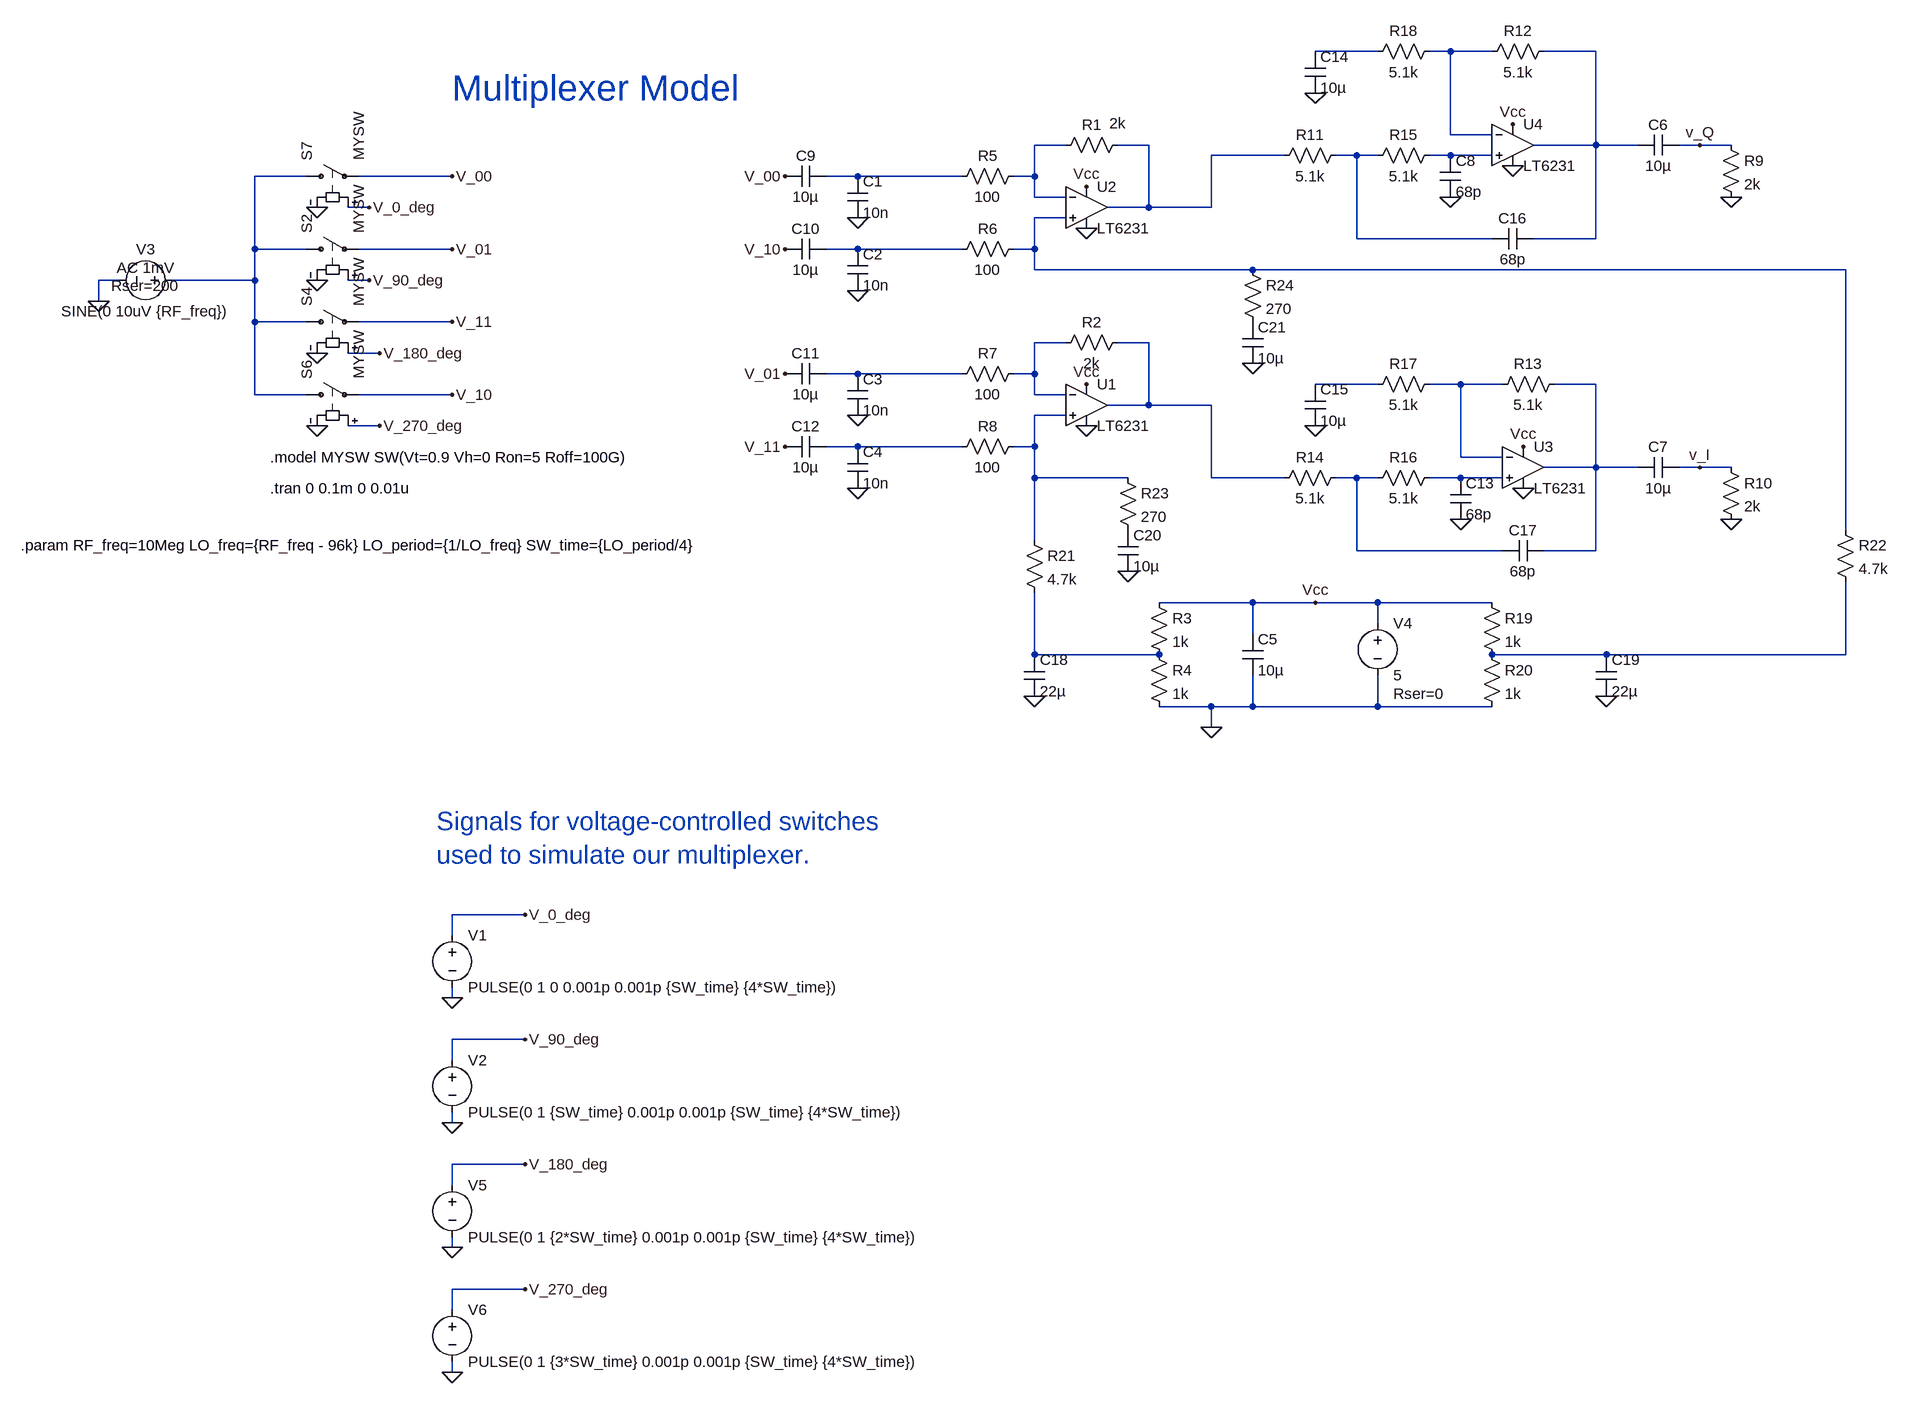
[diagram p0: schematic MUXModel_3.asc]
MUXModel_3.asc, the LTspice schematic file:
Version 4
SHEET 1 2640 1364
WIRE 1376 -688 1280 -688
WIRE 1488 -688 1456 -688
WIRE 1552 -688 1488 -688
WIRE 1712 -688 1632 -688
WIRE 1488 -560 1488 -688
WIRE 1552 -560 1488 -560
WIRE 896 -544 848 -544
WIRE 1024 -544 976 -544
WIRE 1712 -544 1712 -688
WIRE 1712 -544 1616 -544
WIRE 1776 -544 1712 -544
WIRE 1872 -544 1840 -544
WIRE 1920 -544 1872 -544
WIRE 1232 -528 1120 -528
WIRE 1344 -528 1312 -528
WIRE 1376 -528 1344 -528
WIRE 1488 -528 1456 -528
WIRE 1552 -528 1488 -528
WIRE -272 -496 -352 -496
WIRE -48 -496 -192 -496
WIRE 576 -496 528 -496
WIRE 736 -496 576 -496
WIRE 848 -496 848 -544
WIRE 848 -496 816 -496
WIRE 848 -464 848 -496
WIRE 896 -464 848 -464
WIRE -176 -448 -208 -448
WIRE 1024 -448 1024 -544
WIRE 1024 -448 960 -448
WIRE 1120 -448 1120 -528
WIRE 1120 -448 1024 -448
WIRE 896 -432 848 -432
WIRE 1344 -400 1344 -528
WIRE 1552 -400 1344 -400
WIRE 1712 -400 1712 -544
WIRE 1712 -400 1616 -400
WIRE -352 -384 -352 -496
WIRE -272 -384 -352 -384
WIRE -48 -384 -192 -384
WIRE 576 -384 528 -384
WIRE 736 -384 576 -384
WIRE 848 -384 848 -432
WIRE 848 -384 816 -384
WIRE 848 -352 848 -384
WIRE 1184 -352 848 -352
WIRE 2096 -352 1184 -352
WIRE -560 -336 -592 -336
WIRE -352 -336 -352 -384
WIRE -352 -336 -480 -336
WIRE -176 -336 -208 -336
WIRE -592 -304 -592 -336
WIRE -352 -272 -352 -336
WIRE -272 -272 -352 -272
WIRE -48 -272 -192 -272
WIRE 896 -240 848 -240
WIRE 1024 -240 976 -240
WIRE -160 -224 -208 -224
WIRE 576 -192 528 -192
WIRE 736 -192 576 -192
WIRE 848 -192 848 -240
WIRE 848 -192 816 -192
WIRE 1376 -176 1280 -176
WIRE 1504 -176 1456 -176
WIRE 1568 -176 1504 -176
WIRE 1712 -176 1648 -176
WIRE -352 -160 -352 -272
WIRE -272 -160 -352 -160
WIRE -48 -160 -192 -160
WIRE 848 -160 848 -192
WIRE 896 -160 848 -160
WIRE 1024 -144 1024 -240
WIRE 1024 -144 960 -144
WIRE 1120 -144 1024 -144
WIRE 896 -128 848 -128
WIRE -160 -112 -208 -112
WIRE 576 -80 528 -80
WIRE 736 -80 576 -80
WIRE 848 -80 848 -128
WIRE 848 -80 816 -80
WIRE 1504 -64 1504 -176
WIRE 1568 -64 1504 -64
WIRE 1712 -48 1712 -176
WIRE 1712 -48 1632 -48
WIRE 1776 -48 1712 -48
WIRE 1872 -48 1840 -48
WIRE 1920 -48 1872 -48
WIRE 848 -32 848 -80
WIRE 992 -32 848 -32
WIRE 1120 -32 1120 -144
WIRE 1232 -32 1120 -32
WIRE 1344 -32 1312 -32
WIRE 1376 -32 1344 -32
WIRE 1504 -32 1456 -32
WIRE 1568 -32 1504 -32
WIRE 2096 48 2096 -352
WIRE 848 64 848 -32
WIRE 1344 80 1344 -32
WIRE 1568 80 1344 80
WIRE 1712 80 1712 -48
WIRE 1712 80 1632 80
WIRE 1184 160 1040 160
WIRE 1280 160 1184 160
WIRE 1376 160 1280 160
WIRE 1552 160 1376 160
WIRE 1376 192 1376 160
WIRE 1184 208 1184 160
WIRE 848 240 848 144
WIRE 1040 240 848 240
WIRE 1728 240 1552 240
WIRE 2096 240 2096 128
WIRE 2096 240 1728 240
WIRE 1120 320 1040 320
WIRE 1184 320 1184 272
WIRE 1184 320 1120 320
WIRE 1376 320 1376 272
WIRE 1376 320 1184 320
WIRE 1552 320 1376 320
WIRE 1120 352 1120 320
WIRE 64 640 -48 640
WIRE -48 672 -48 640
WIRE -48 768 -48 752
WIRE 64 832 -48 832
WIRE -48 864 -48 832
WIRE -48 960 -48 944
WIRE 64 1024 -48 1024
WIRE -48 1056 -48 1024
WIRE -48 1152 -48 1136
WIRE 64 1216 -48 1216
WIRE -48 1248 -48 1216
WIRE -48 1344 -48 1328
FLAG -256 -448 0
FLAG -256 -336 0
FLAG -256 -224 0
FLAG -256 -112 0
FLAG -592 -304 0
FLAG 576 -432 0
FLAG 576 -320 0
FLAG 576 -128 0
FLAG 576 -16 0
FLAG 928 -416 0
FLAG 928 -112 0
FLAG 1120 352 0
FLAG 1280 160 Vcc
FLAG 928 -176 Vcc
FLAG 928 -480 Vcc
FLAG 1584 -512 0
FLAG 1600 -16 0
FLAG 1584 -576 Vcc
FLAG 1600 -80 Vcc
FLAG 1504 32 0
FLAG 1488 -464 0
FLAG 1280 -112 0
FLAG 1280 -624 0
FLAG 1920 32 0
FLAG 1920 -464 0
FLAG -160 -112 V_270_deg
FLAG -160 -224 V_180_deg
FLAG -176 -336 V_90_deg
FLAG -176 -448 V_0_deg
FLAG -48 768 0
FLAG 64 640 V_0_deg
FLAG -48 960 0
FLAG 64 832 V_90_deg
FLAG -48 1152 0
FLAG 64 1024 V_180_deg
FLAG -48 1344 0
FLAG 64 1216 V_270_deg
FLAG 1872 -544 v_Q
FLAG 1872 -48 v_I
FLAG -48 -496 V_00
FLAG -48 -384 V_01
FLAG -48 -272 V_11
FLAG 464 -384 V_10
FLAG 464 -80 V_11
FLAG -48 -160 V_10
FLAG 1728 304 0
FLAG 848 304 0
FLAG 992 112 0
FLAG 1184 -208 0
FLAG 464 -496 V_00
FLAG 464 -192 V_01
SYMBOL sw -288 -496 R270
SYMATTR InstName S7
SYMATTR Value MYSW
SYMBOL sw -288 -384 R270
SYMATTR InstName S2
SYMATTR Value MYSW
SYMBOL sw -288 -272 R270
SYMATTR InstName S4
SYMATTR Value MYSW
SYMBOL sw -288 -160 R270
SYMATTR InstName S6
SYMATTR Value MYSW
SYMBOL voltage -464 -336 R90
WINDOW 0 -32 56 VBottom 2
WINDOW 3 32 56 VTop 2
WINDOW 123 -4 56 VBottom 2
WINDOW 39 24 56 VBottom 2
SYMATTR InstName V3
SYMATTR Value SINE(0 10uV {RF_freq})
SYMATTR Value2 AC 1mV
SYMATTR SpiceLine Rser=200
SYMBOL cap 560 -496 R0
SYMATTR InstName C1
SYMATTR Value 10n
SYMBOL cap 560 -384 R0
SYMATTR InstName C2
SYMATTR Value 10n
SYMBOL cap 560 -192 R0
SYMATTR InstName C3
SYMATTR Value 10n
SYMBOL cap 560 -80 R0
SYMATTR InstName C4
SYMATTR Value 10n
SYMBOL res 832 -512 R90
WINDOW 0 0 56 VBottom 2
WINDOW 3 32 56 VTop 2
SYMATTR InstName R5
SYMATTR Value 100
SYMBOL res 832 -400 R90
WINDOW 0 0 56 VBottom 2
WINDOW 3 32 56 VTop 2
SYMATTR InstName R6
SYMATTR Value 100
SYMBOL res 832 -208 R90
WINDOW 0 0 56 VBottom 2
WINDOW 3 32 56 VTop 2
SYMATTR InstName R7
SYMATTR Value 100
SYMBOL res 832 -96 R90
WINDOW 0 0 56 VBottom 2
WINDOW 3 32 56 VTop 2
SYMATTR InstName R8
SYMATTR Value 100
SYMBOL cap 528 -512 R90
WINDOW 0 0 32 VBottom 2
WINDOW 3 32 32 VTop 2
SYMATTR InstName C9
SYMATTR Value 10µ
SYMBOL cap 528 -400 R90
WINDOW 0 0 32 VBottom 2
WINDOW 3 32 32 VTop 2
SYMATTR InstName C10
SYMATTR Value 10µ
SYMBOL cap 528 -208 R90
WINDOW 0 0 32 VBottom 2
WINDOW 3 32 32 VTop 2
SYMATTR InstName C11
SYMATTR Value 10µ
SYMBOL cap 528 -96 R90
WINDOW 0 0 32 VBottom 2
WINDOW 3 32 32 VTop 2
SYMATTR InstName C12
SYMATTR Value 10µ
SYMBOL res 992 -560 R90
WINDOW 0 0 56 VBottom 2
WINDOW 3 -33 16 VTop 2
SYMATTR InstName R1
SYMATTR Value 2k
SYMBOL res 992 -256 R90
WINDOW 0 0 56 VBottom 2
WINDOW 3 32 56 VTop 2
SYMATTR InstName R2
SYMATTR Value 2k
SYMBOL res 1024 144 R0
SYMATTR InstName R3
SYMATTR Value 1k
SYMBOL res 1024 224 R0
SYMATTR InstName R4
SYMATTR Value 1k
SYMBOL cap 1168 208 R0
SYMATTR InstName C5
SYMATTR Value 10µ
SYMBOL voltage 1376 176 R0
WINDOW 123 0 0 Left 0
WINDOW 39 24 124 Left 2
SYMATTR SpiceLine Rser=0
SYMATTR InstName V4
SYMATTR Value 5
SYMBOL res 1328 -544 R90
WINDOW 0 0 56 VBottom 2
WINDOW 3 32 56 VTop 2
SYMATTR InstName R11
SYMATTR Value 5.1k
SYMBOL res 1648 -704 R90
WINDOW 0 0 56 VBottom 2
WINDOW 3 32 56 VTop 2
SYMATTR InstName R12
SYMATTR Value 5.1k
SYMBOL res 1664 -192 R90
WINDOW 0 0 56 VBottom 2
WINDOW 3 32 56 VTop 2
SYMATTR InstName R13
SYMATTR Value 5.1k
SYMBOL res 1328 -48 R90
WINDOW 0 0 56 VBottom 2
WINDOW 3 32 56 VTop 2
SYMATTR InstName R14
SYMATTR Value 5.1k
SYMBOL res 1472 -544 R90
WINDOW 0 0 56 VBottom 2
WINDOW 3 32 56 VTop 2
SYMATTR InstName R15
SYMATTR Value 5.1k
SYMBOL res 1472 -48 R90
WINDOW 0 0 56 VBottom 2
WINDOW 3 32 56 VTop 2
SYMATTR InstName R16
SYMATTR Value 5.1k
SYMBOL cap 1472 -528 R0
SYMATTR InstName C8
SYMATTR Value 68p
SYMBOL cap 1488 -32 R0
SYMATTR InstName C13
SYMATTR Value 68p
SYMBOL res 1472 -192 R90
WINDOW 0 0 56 VBottom 2
WINDOW 3 32 56 VTop 2
SYMATTR InstName R17
SYMATTR Value 5.1k
SYMBOL res 1472 -704 R90
WINDOW 0 0 56 VBottom 2
WINDOW 3 32 56 VTop 2
SYMATTR InstName R18
SYMATTR Value 5.1k
SYMBOL cap 1264 -688 R0
SYMATTR InstName C14
SYMATTR Value 10µ
SYMBOL cap 1264 -176 R0
SYMATTR InstName C15
SYMATTR Value 10µ
SYMBOL cap 1840 -560 R90
WINDOW 0 0 32 VBottom 2
WINDOW 3 32 32 VTop 2
SYMATTR InstName C6
SYMATTR Value 10µ
SYMBOL cap 1840 -64 R90
WINDOW 0 0 32 VBottom 2
WINDOW 3 32 32 VTop 2
SYMATTR InstName C7
SYMATTR Value 10µ
SYMBOL res 1904 -560 R0
SYMATTR InstName R9
SYMATTR Value 2k
SYMBOL res 1904 -64 R0
SYMATTR InstName R10
SYMATTR Value 2k
SYMBOL cap 1616 -416 R90
WINDOW 0 0 32 VBottom 2
WINDOW 3 32 32 VTop 2
SYMATTR InstName C16
SYMATTR Value 68p
SYMBOL cap 1632 64 R90
WINDOW 0 0 32 VBottom 2
WINDOW 3 32 32 VTop 2
SYMATTR InstName C17
SYMATTR Value 68p
SYMBOL OpAmps\\LT6231 1600 -48 R0
SYMATTR InstName U3
SYMBOL OpAmps\\LT6231 1584 -544 R0
SYMATTR InstName U4
SYMBOL OpAmps\\LT6231 928 -144 R0
SYMATTR InstName U1
SYMBOL OpAmps\\LT6231 928 -448 R0
SYMATTR InstName U2
SYMBOL res 1536 144 R0
SYMATTR InstName R19
SYMATTR Value 1k
SYMBOL res 1536 224 R0
SYMATTR InstName R20
SYMATTR Value 1k
SYMBOL voltage -48 656 R0
WINDOW 123 0 0 Left 0
WINDOW 39 0 0 Left 0
SYMATTR InstName V1
SYMATTR Value PULSE(0 1 0 0.001p 0.001p {SW_time} {4*SW_time})
SYMBOL voltage -48 848 R0
WINDOW 123 0 0 Left 0
WINDOW 39 0 0 Left 0
SYMATTR InstName V2
SYMATTR Value PULSE(0 1 {SW_time} 0.001p 0.001p {SW_time} {4*SW_time})
SYMBOL voltage -48 1040 R0
WINDOW 123 0 0 Left 0
WINDOW 39 0 0 Left 0
SYMATTR InstName V5
SYMATTR Value PULSE(0 1 {2*SW_time} 0.001p 0.001p {SW_time} {4*SW_time})
SYMBOL voltage -48 1232 R0
WINDOW 123 0 0 Left 0
WINDOW 39 0 0 Left 0
SYMATTR InstName V6
SYMATTR Value PULSE(0 1 {3*SW_time} 0.001p 0.001p {SW_time} {4*SW_time})
SYMBOL res 832 48 R0
SYMATTR InstName R21
SYMATTR Value 4.7k
SYMBOL res 2080 32 R0
SYMATTR InstName R22
SYMATTR Value 4.7k
SYMBOL cap 832 240 R0
SYMATTR InstName C18
SYMATTR Value 22µ
SYMBOL cap 1712 240 R0
SYMATTR InstName C19
SYMATTR Value 22µ
SYMBOL res 976 -48 R0
SYMATTR InstName R23
SYMATTR Value 270
SYMBOL cap 976 48 R0
SYMATTR InstName C20
SYMATTR Value 10µ
SYMBOL res 1168 -368 R0
SYMATTR InstName R24
SYMATTR Value 270
SYMBOL cap 1168 -272 R0
SYMATTR InstName C21
SYMATTR Value 10µ
TEXT -328 -64 Left 2 !.model MYSW SW(Vt=0.9 Vh=0 Ron=5 Roff=100G)
TEXT -328 -16 Left 2 !.tran 0 0.1m 0 0.01u
TEXT -48 -632 Left 5 ;Multiplexer Model
TEXT -72 496 Left 4 ;Signals for voltage-controlled switches \nused to simulate our multiplexer.
TEXT -712 72 Left 2 !.param RF_freq=10Meg LO_freq={RF_freq - 96k} LO_period={1/LO_freq} SW_time={LO_period/4}

The netlist it stands for:
* MUXModel_3.asc
S7 N008 V_00 V_0_deg 0 MYSW
S2 N008 V_01 V_90_deg 0 MYSW
S4 N008 V_11 V_180_deg 0 MYSW
S6 N008 V_10 V_270_deg 0 MYSW
V3 N008 0 SINE(0 10uV {RF_freq}) AC 1mV Rser=200
C1 N009 0 10n
C2 N011 0 10n
C3 N014 0 10n
C4 N019 0 10n
R5 N004 N009 100
R6 N010 N011 100
R7 N012 N014 100
R8 N018 N019 100
C9 N009 V_00 10µ
C10 N011 V_10 10µ
C11 N014 V_01 10µ
C12 N019 V_11 10µ
R1 N005 N004 2k
R2 N013 N012 2k
R3 Vcc N022 1k
R4 N022 0 1k
C5 Vcc 0 10µ
V4 Vcc 0 5 Rser=0
R11 N006 N005 5.1k
R12 N003 N002 5.1k
R13 N017 N016 5.1k
R14 N020 N013 5.1k
R15 N007 N006 5.1k
R16 N021 N020 5.1k
C8 N007 0 68p
C13 N021 0 68p
R17 N016 N015 5.1k
R18 N002 N001 5.1k
C14 N001 0 10µ
C15 N015 0 10µ
C6 v_Q N003 10µ
C7 v_I N017 10µ
R9 v_Q 0 2k
R10 v_I 0 2k
C16 N003 N006 68p
C17 N017 N020 68p
XU3 N021 N016 N017 Vcc 0 LT6231  ; pins In+ In- OUT V+ V-
XU4 N007 N002 N003 Vcc 0 LT6231  ; pins In+ In- OUT V+ V-
XU1 N018 N012 N013 Vcc 0 LT6231  ; pins In+ In- OUT V+ V-
XU2 N010 N004 N005 Vcc 0 LT6231  ; pins In+ In- OUT V+ V-
R19 Vcc N023 1k
R20 N023 0 1k
V1 V_0_deg 0 PULSE(0 1 0 0.001p 0.001p {SW_time} {4*SW_time})
V2 V_90_deg 0 PULSE(0 1 {SW_time} 0.001p 0.001p {SW_time} {4*SW_time})
V5 V_180_deg 0 PULSE(0 1 {2*SW_time} 0.001p 0.001p {SW_time} {4*SW_time})
V6 V_270_deg 0 PULSE(0 1 {3*SW_time} 0.001p 0.001p {SW_time} {4*SW_time})
R21 N018 N022 4.7k
R22 N010 N023 4.7k
C18 N022 0 22µ
C19 N023 0 22µ
R23 N018 P001 270
C20 P001 0 10µ
R24 N010 P002 270
C21 P002 0 10µ
.model MYSW SW(Vt=0.9 Vh=0 Ron=5 Roff=100G)
.tran 0 0.1m 0 0.01u
* Multiplexer Model
* Signals for voltage-controlled switches
* used to simulate our multiplexer.
.param RF_freq=10Meg LO_freq={RF_freq - 96k} LO_period={1/LO_freq} SW_time={LO_period/4}
.lib LTC2.lib
.backanno
.end